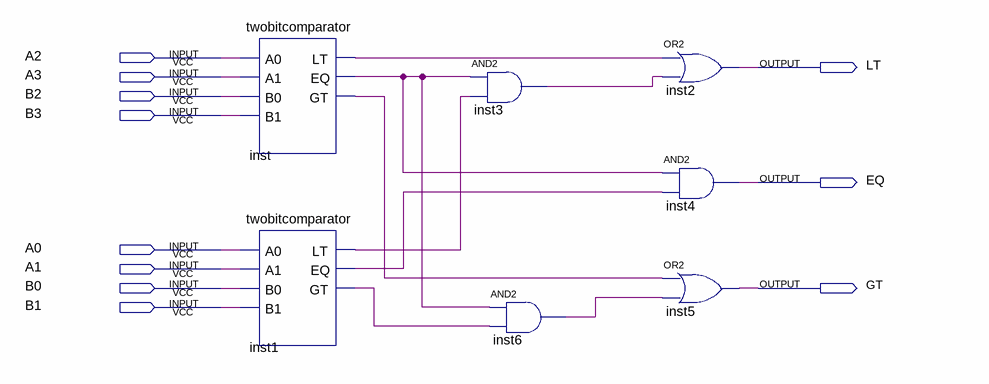
[diagram p0: schematic sheet]
// Quartus schematic week3_ex3.bdf as structural Verilog: 7 symbols, 11 pins
module week3_ex3 (
  input  A2,
  input  A3,
  input  B2,
  input  B3,
  input  A0,
  input  A1,
  input  B0,
  input  B1,
  output LT,
  output EQ,
  output GT
);

  wire inst1_eq, inst1_gt, inst1_lt, inst3_out, inst6_out, inst_eq, inst_gt, inst_lt;

  twobitcomparator inst (.A0(A2), .A1(A3), .B0(B2), .B1(B3), .LT(inst_lt), .EQ(inst_eq), .GT(inst_gt));
  twobitcomparator inst1 (.A0(A0), .A1(A1), .B0(B0), .B1(B1), .LT(inst1_lt), .EQ(inst1_eq), .GT(inst1_gt));
  and inst3 (inst3_out, inst_eq, inst1_lt);
  and inst6 (inst6_out, inst_eq, inst1_gt);
  or inst2 (LT, inst_lt, inst3_out);
  and inst4 (EQ, inst_eq, inst1_eq);
  or inst5 (GT, inst_gt, inst6_out);
endmodule
